# Altium project lab1.PrjPcb
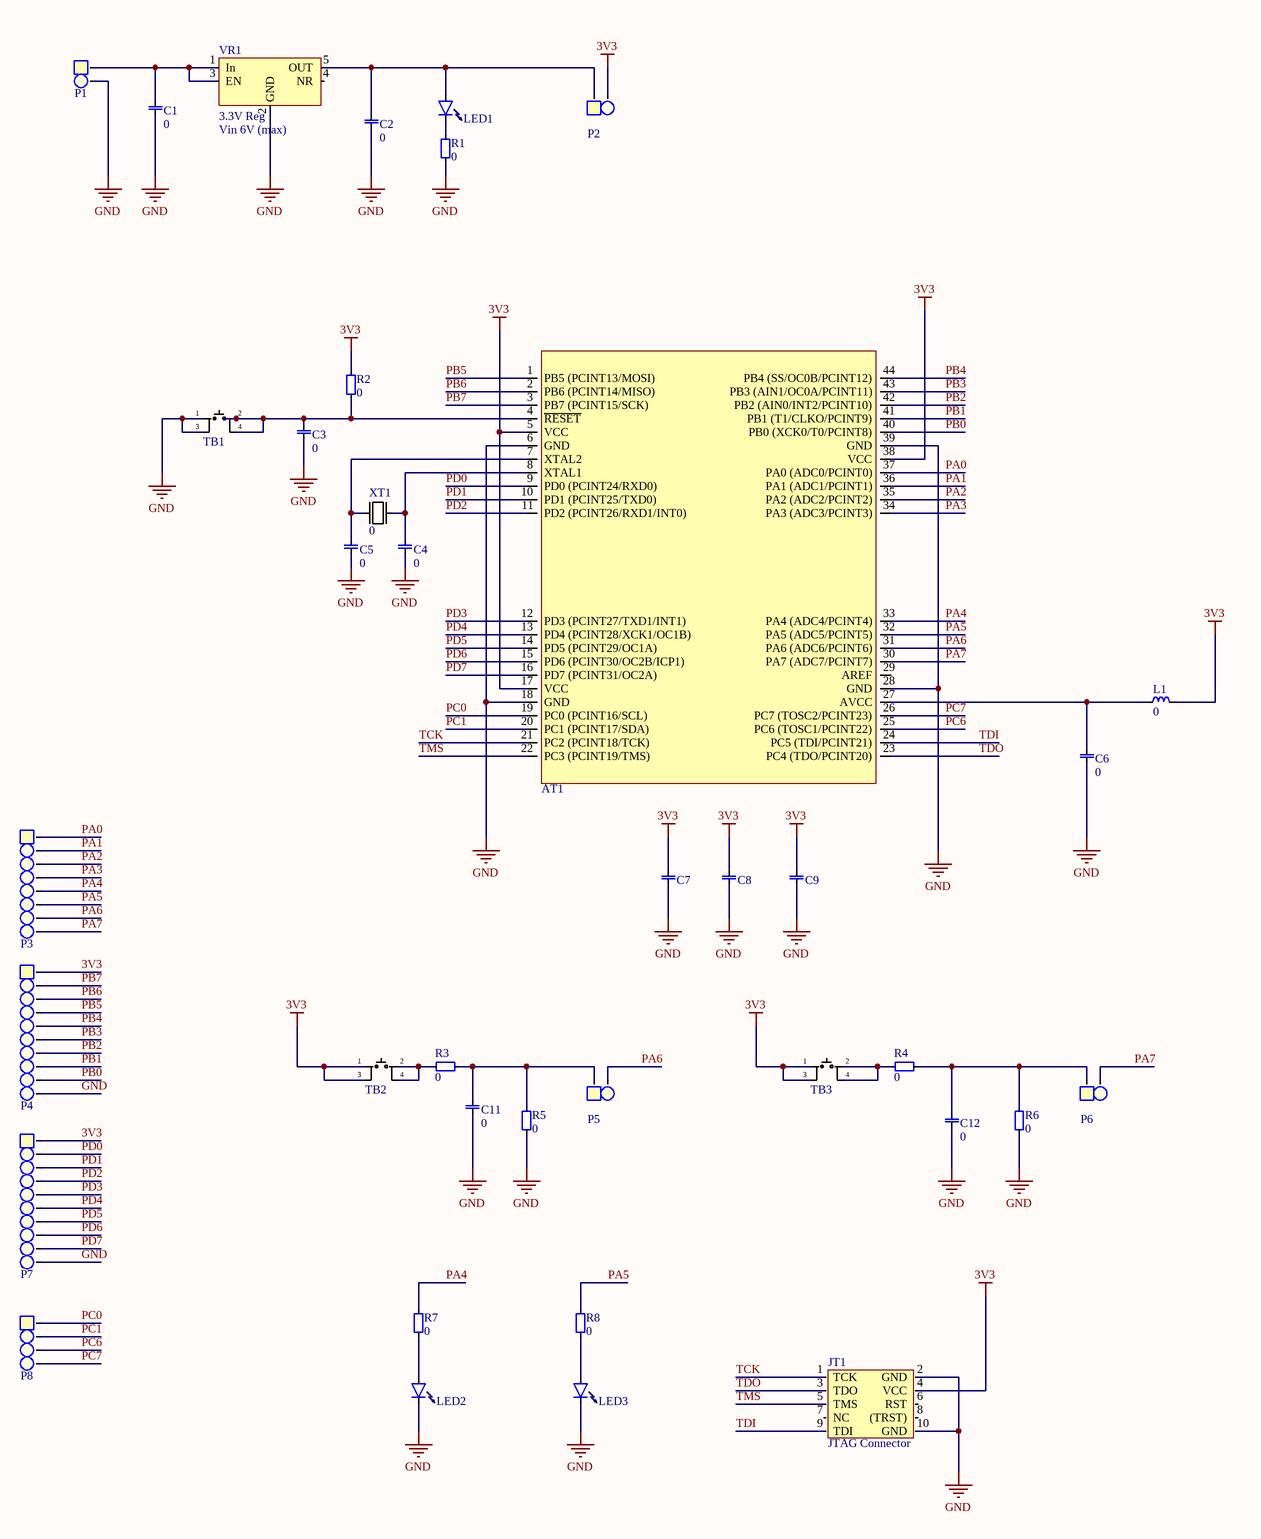
[diagram p0: lab1.SchDoc]
1 sheet, 38 parts. Net scope: global (net labels, ports and power ports of the same name join across sheets).
Board file: lab1.PcbDoc

## Sheet lab1.SchDoc
size A3 portrait

### Parts
AT1  ATmega644PA  [TQFP-44]  (value not drawn)
C1  value 0  [1206, capasitor]  (hidden comment: 1206, capacitor)
C2  value 0  [1206, capasitor]  (hidden comment: 1206, capacitor)
C3  value 0  [1206, capasitor]  (hidden comment: 1206, capacitor)
C4  value 0  [1206, capasitor]  (hidden comment: 1206, capacitor)
C5  value 0  [1206, capasitor]  (hidden comment: 1206, capacitor)
C6  value 0  [1206, capasitor]  (hidden comment: 1206, capacitor)
C7  1206, capacitor  [1206, capasitor]  (value not drawn)
C8  1206, capacitor  [1206, capasitor]  (value not drawn)
C9  1206, capacitor  [1206, capasitor]  (value not drawn)
C11  value 0  [1206, capasitor]  (hidden comment: 1206, capacitor)
C12  value 0  [1206, capasitor]  (hidden comment: 1206, capacitor)
JT1  JTAG Connector  [Atmel_JTAG]
L1  value 0  [1812, coil]  (hidden comment: Coil)
LED1  0805, LED  [0805_led]  (value not drawn)
LED2  0805, LED  [0805_led]  (value not drawn)
LED3  0805, LED  [0805_led]  (value not drawn)
P1  1x2 Pin Header  [1x2HEADER]  (value not drawn)
P2  1x2 Pin Header  [1x2HEADER]  (value not drawn)
P3  1x8 Pin Header  [1x8HEADER]  (value not drawn)
P4  1x10 Pin Header  [1x10HEADER]  (value not drawn)
P5  1x2 Pin Header  [1x2HEADER]  (value not drawn)
P6  1x2 Pin Header  [1x2HEADER]  (value not drawn)
P7  1x10 Pin Header  [1x10HEADER]  (value not drawn)
P8  1x4 Pin Header  [1x4HEADER]  (value not drawn)
R1  value 0  [1206]  (hidden comment: 1206, resistor)
R2  value 0  [1206]  (hidden comment: 1206, resistor)
R3  value 0  [1206]  (hidden comment: 1206, resistor)
R4  value 0  [1206]  (hidden comment: 1206, resistor)
R5  value 0  [1206]  (hidden comment: 1206, resistor)
R6  value 0  [1206]  (hidden comment: 1206, resistor)
R7  value 0  [1206]  (hidden comment: 1206, resistor)
R8  value 0  [1206]  (hidden comment: 1206, resistor)
TB1  Tactile Button  [Button smd]  (value not drawn)
TB2  Tactile Button  [Button smd]  (value not drawn)
TB3  Tactile Button  [Button smd]  (value not drawn)
VR1  3.3V Reg  Input Voltage: Vin 6V (max)  [SOT23-5]
XT1  value 0  [XTAL_SMD_LP]  (hidden comment: XTAL TXC 7A)

### Nets
3V3: AT1.5(VCC) AT1.17(VCC) AT1.38(VCC) C7.1 C8.1 C9.1 JT1.4(VCC) L1.1 P2.2 P4.1 P7.1 R2.0 TB2.1 TB2.3 TB3.1 TB3.3
GND: AT1.6(GND) AT1.18(GND) AT1.28(GND) AT1.39(GND) C1.0 C2.0 C3.0 C4.0 C5.0 C6.0 C7.0 C8.0 C9.0 C11.0 C12.0 JT1.2(GND) JT1.10(GND) LED2.0(Cathode) LED3.0(Cathode) P1.2 P4.10 P7.10 R1.1 R5.1 R6.1 TB1.1 TB1.3 VR1.2(GND)
PA0: AT1.37(PA0_(ADC0/PCINT0)) P3.1
PA1: AT1.36(PA1_(ADC1/PCINT1)) P3.2
PA2: AT1.35(PA2_(ADC2/PCINT2)) P3.3
PA3: AT1.34(PA3_(ADC3/PCINT3)) P3.4
PA4: AT1.33(PA4_(ADC4/PCINT4)) P3.5 R7.0
PA5: AT1.32(PA5_(ADC5/PCINT5)) P3.6 R8.0
PA6: AT1.31(PA6_(ADC6/PCINT6)) P3.7 P5.2
PA7: AT1.30(PA7_(ADC7/PCINT7)) P3.8 P6.2
PB0: AT1.40(PB0_(XCK0/T0/PCINT8)) P4.9
PB1: AT1.41(PB1_(T1/CLKO/PCINT9)) P4.8
PB2: AT1.42(PB2_(AIN0/INT2/PCINT10)) P4.7
PB3: AT1.43(PB3_(AIN1/OC0A/PCINT11)) P4.6
PB4: AT1.44(PB4_(SS/OC0B/PCINT12)) P4.5
PB5: AT1.1(PB5_(PCINT13/MOSI)) P4.4
PB6: AT1.2(PB6_(PCINT14/MISO)) P4.3
PB7: AT1.3(PB7_(PCINT15/SCK)) P4.2
PC0: AT1.19(PC0_(PCINT16/SCL)) P8.1
PC1: AT1.20(PC1_(PCINT17/SDA)) P8.2
PC6: AT1.25(PC6_(TOSC1/PCINT22)) P8.3
PC7: AT1.26(PC7_(TOSC2/PCINT23)) P8.4
PD0: AT1.9(PD0_(PCINT24/RXD0)) P7.2
PD1: AT1.10(PD1_(PCINT25/TXD0)) P7.3
PD2: AT1.11(PD2_(PCINT26/RXD1/INT0)) P7.4
PD3: AT1.12(PD3_(PCINT27/TXD1/INT1)) P7.5
PD4: AT1.13(PD4_(PCINT28/XCK1/OC1B)) P7.6
PD5: AT1.14(PD5_(PCINT29/OC1A)) P7.7
PD6: AT1.15(PD6_(PCINT30/OC2B/ICP1)) P7.8
PD7: AT1.16(PD7_(PCINT31/OC2A)) P7.9
TCK: AT1.21(PC2_(PCINT18/TCK)) JT1.1(TCK)
TDI: AT1.24(PC5_(TDI/PCINT21)) JT1.9(TDI)
TDO: AT1.23(PC4_(TDO/PCINT20)) JT1.3(TDO)
TMS: AT1.22(PC3_(PCINT19/TMS)) JT1.5(TMS)
NetAT1_4: AT1.4(~{RESET}) C3.1 R2.1 TB1.2 TB1.4
NetAT1_7: AT1.7(XTAL2) C5.1 XT1.1
NetAT1_8: AT1.8(XTAL1) C4.1 XT1.2
NetAT1_27: AT1.27(AVCC) C6.1 L1.2
NetC1_1: C1.1 P1.1 VR1.1(In) VR1.3(EN)
NetC2_1: C2.1 LED1.1 P2.1 VR1.5(OUT)
NetC11_1: C11.1 P5.1 R3.0 R5.0
NetC12_1: C12.1 P6.1 R4.0 R6.0
NetLED1_0: LED1.0(Cathode) R1.0
NetLED2_1: LED2.1 R7.1
NetLED3_1: LED3.1 R8.1
NetR3_1: R3.1 TB2.2 TB2.4
NetR4_1: R4.1 TB3.2 TB3.4

Not connected (* = marked no-connect by the designer): AT1 29(AREF); JT1 6(RST) 7(NC) 8((TRST)); VR1 4(NR)

### Library data of the parts
AT1 = ATmega644PA: ATmega644PA - Small but big and PicoPower; Farnell: 2484915; Value: ATmega644PA
JT1 = Atmel JTAG: Atmel JTAG Connector
LED1-LED3 = 0805, LED: Value: 0805 LED
P1 P2 P5 P6 = 1x2 Pin Header: 2.54 mm, TH; Value: 1x2 Pin Header
P3 = 1x8 Pin Header: 2.54 mm, TH; Value: 1x2 Pin Header
P4 P7 = 1x10 Pin Header: 2.54 mm, TH; Value: 1x2 Pin Header
P8 = 1x4 Pin Header: 2.54 mm, TH; Value: 1x2 Pin Header
R1-R8 = 1206, resistor: Resistor
TB1-TB3 = Button SMD: Tactile Switch Small Low; ELFA: 110-87-406; Value: Button SMD
VR1 = TPS79333DBR: 3.3V Reg, Ultra-Low Noise, 200 mA; Value: TPS79333DBVR; Drop Out: 102mV; Farnell: 1287689
XT1 = XTAL TXC 7A: 16 MHz, SMD, 5mm x 3,2mm, 30 ppm; Farnell: 1841946